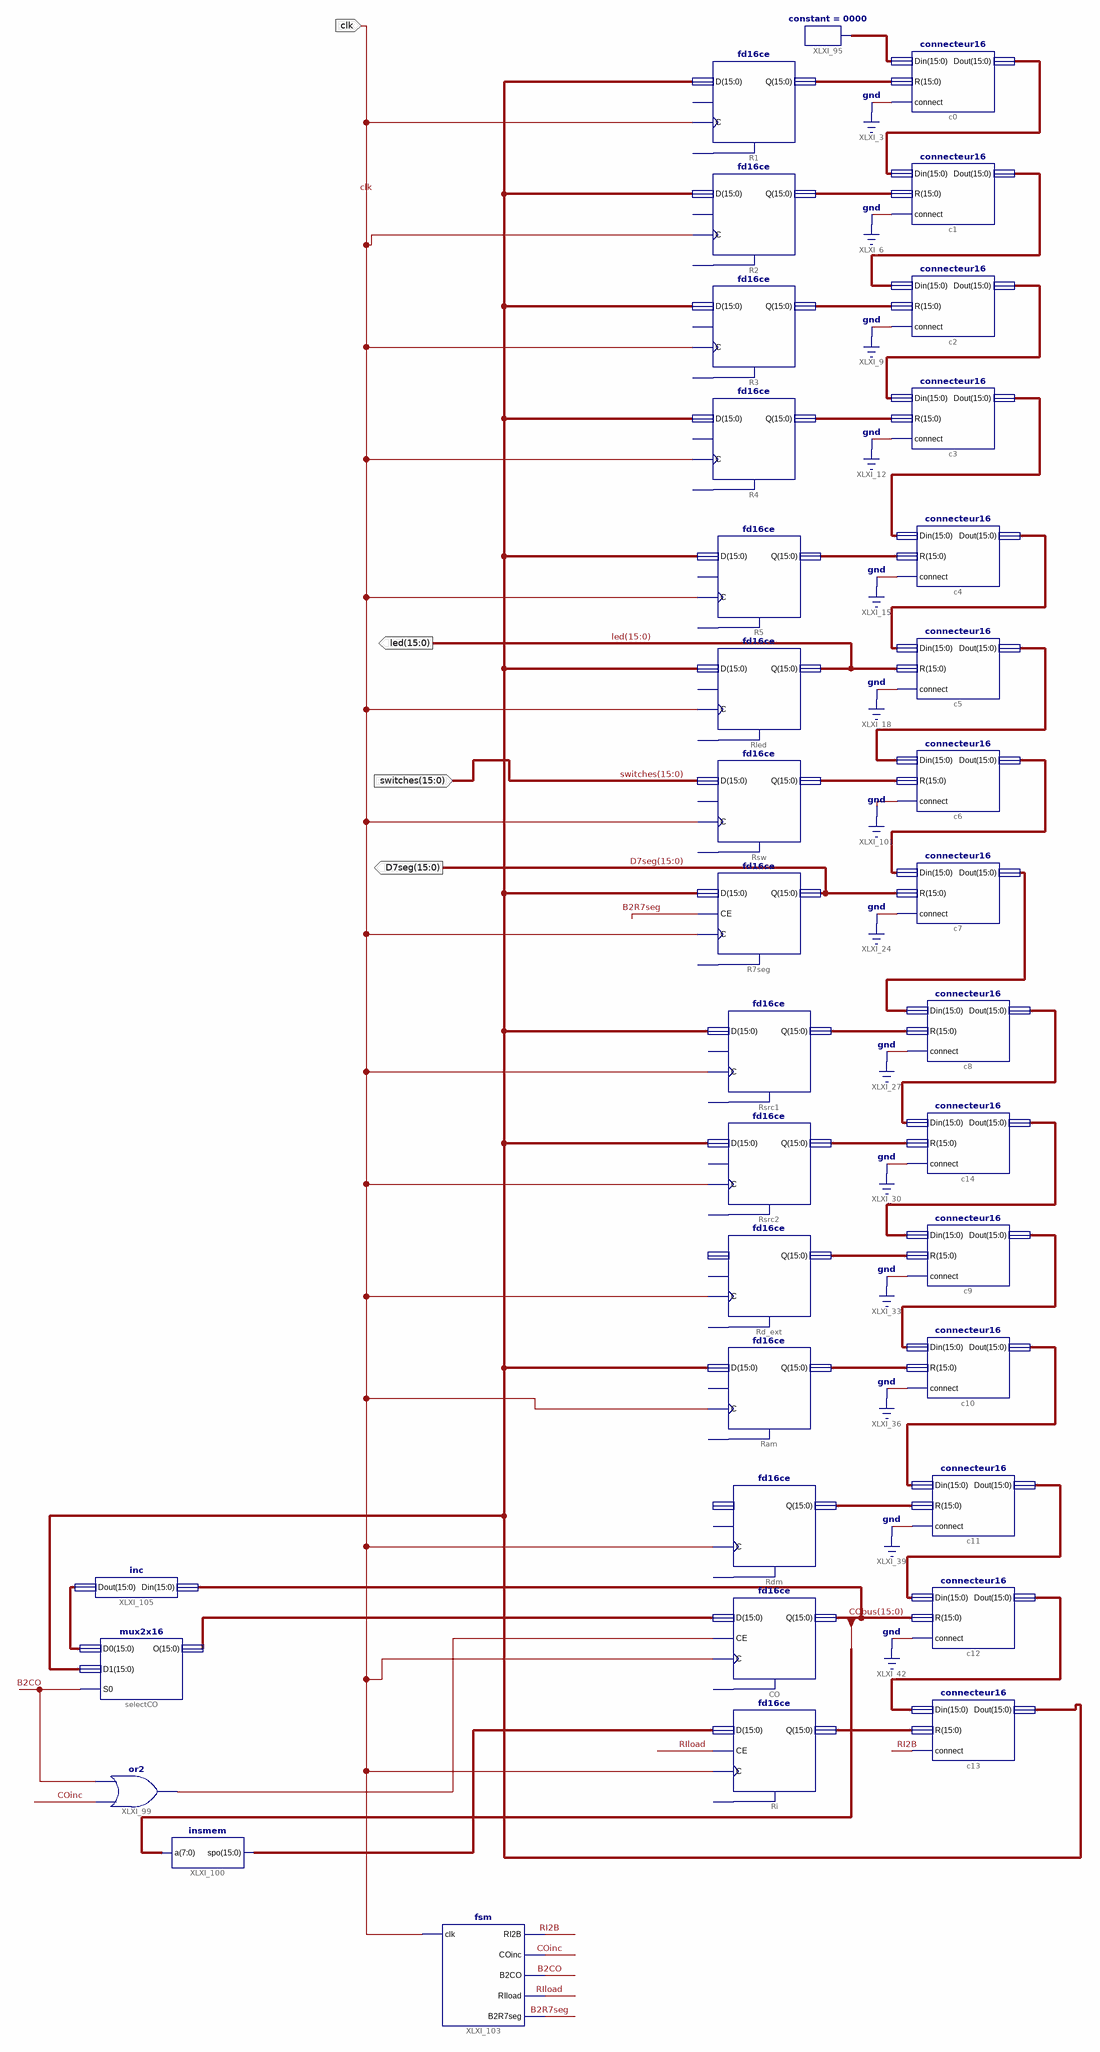
[diagram p0: schematic sheet 1]
// Xilinx ISE schematic S3.sch (spartan3e) as structural Verilog: 36 symbols, 4 ports
module S3 (
  input  clk,
  input  [15:0] switches,
  output [15:0] led,
  output [15:0] D7seg
);

  wire B2CO, B2R7seg, COinc, RI2B, RIload, XLXN_133;
  wire [15:0] CObus, R3out, R4out2, R7segout2, Rdextout2, Rdmout, Rsrc1out2, Rsrc2out, XLXN_1, XLXN_3,
       XLXN_5, XLXN_8, XLXN_10, XLXN_13, XLXN_15, XLXN_19, XLXN_21, XLXN_25, XLXN_27, XLXN_33, XLXN_34,
       XLXN_36, XLXN_40, XLXN_48, XLXN_51, XLXN_54, XLXN_57, XLXN_115, XLXN_119, XLXN_131, XLXN_134, XLXN_666;

  fd16ce R1 (.C(clk), .D(XLXN_119), .Q(XLXN_1));  // open: CE, CLR
  connecteur16 c0 (.Din(XLXN_115), .R(XLXN_1), .connect(1'b0), .Dout(XLXN_5));
  fd16ce R2 (.C(clk), .D(XLXN_119), .Q(XLXN_3));  // open: CE, CLR
  connecteur16 c1 (.Din(XLXN_5), .R(XLXN_3), .connect(1'b0), .Dout(XLXN_13));
  fd16ce R3 (.C(clk), .D(XLXN_119), .Q(R3out));  // open: CE, CLR
  connecteur16 c2 (.Din(XLXN_13), .R(R3out), .connect(1'b0), .Dout(XLXN_10));
  fd16ce R4 (.C(clk), .D(XLXN_119), .Q(XLXN_8));  // open: CE, CLR
  connecteur16 c3 (.Din(XLXN_10), .R(XLXN_8), .connect(1'b0), .Dout(R4out2));
  fd16ce R5 (.C(clk), .D(XLXN_119), .Q(XLXN_15));  // open: CE, CLR
  connecteur16 c4 (.Din(R4out2), .R(XLXN_15), .connect(1'b0), .Dout(XLXN_19));
  fd16ce Rled (.C(clk), .D(XLXN_119), .Q(led));  // open: CE, CLR
  connecteur16 c5 (.Din(XLXN_19), .R(led), .connect(1'b0), .Dout(XLXN_27));
  fd16ce Rsw (.C(clk), .D(switches), .Q(XLXN_21));  // open: CE, CLR
  connecteur16 c6 (.Din(XLXN_27), .R(XLXN_21), .connect(1'b0), .Dout(XLXN_25));
  fd16ce R7seg (.C(clk), .CE(B2R7seg), .D(XLXN_119), .Q(D7seg));  // open: CLR
  connecteur16 c7 (.Din(XLXN_25), .R(D7seg), .connect(1'b0), .Dout(R7segout2));
  fd16ce Rsrc1 (.C(clk), .D(XLXN_119), .Q(XLXN_33));  // open: CE, CLR
  connecteur16 c8 (.Din(R7segout2), .R(XLXN_33), .connect(1'b0), .Dout(Rsrc1out2));
  fd16ce Rsrc2 (.C(clk), .D(XLXN_119), .Q(Rsrc2out));  // open: CE, CLR
  connecteur16 c14 (.Din(Rsrc1out2), .R(Rsrc2out), .connect(1'b0), .Dout(XLXN_40));
  fd16ce Rd_ext (.C(clk), .Q(XLXN_34));  // open: CE, CLR, D
  connecteur16 c9 (.Din(XLXN_40), .R(XLXN_34), .connect(1'b0), .Dout(Rdextout2));
  fd16ce Ram (.C(clk), .D(XLXN_119), .Q(XLXN_36));  // open: CE, CLR
  connecteur16 c10 (.Din(Rdextout2), .R(XLXN_36), .connect(1'b0), .Dout(XLXN_57));
  fd16ce Rdm (.C(clk), .Q(Rdmout));  // open: CE, CLR, D
  connecteur16 c11 (.Din(XLXN_57), .R(Rdmout), .connect(1'b0), .Dout(XLXN_51));
  fd16ce CO (.C(clk), .CE(XLXN_133), .D(XLXN_131), .Q(CObus));  // open: CLR
  connecteur16 c12 (.Din(XLXN_51), .R(CObus), .connect(1'b0), .Dout(XLXN_54));
  fd16ce Ri (.C(clk), .CE(RIload), .D(XLXN_134), .Q(XLXN_48));  // open: CLR
  connecteur16 c13 (.Din(XLXN_54), .R(XLXN_48), .connect(RI2B), .Dout(XLXN_119));
  constant #(.CValue("0000")) XLXI_95 (.O(XLXN_115));
  mux2x16 selectCO (.D0(XLXN_666), .D1(XLXN_119), .S0(B2CO), .O(XLXN_131));
  or XLXI_99 (XLXN_133, COinc, B2CO);
  insmem XLXI_100 (.a(CObus[7:0]), .spo(XLXN_134));
  fsm XLXI_103 (.clk(clk), .RI2B(RI2B), .COinc(COinc), .B2CO(B2CO), .RIload(RIload), .B2R7seg(B2R7seg));
  inc XLXI_105 (.Din(CObus), .Dout(XLXN_666));
endmodule
